# Altium project 宝宝主板_V7.PrjPcb
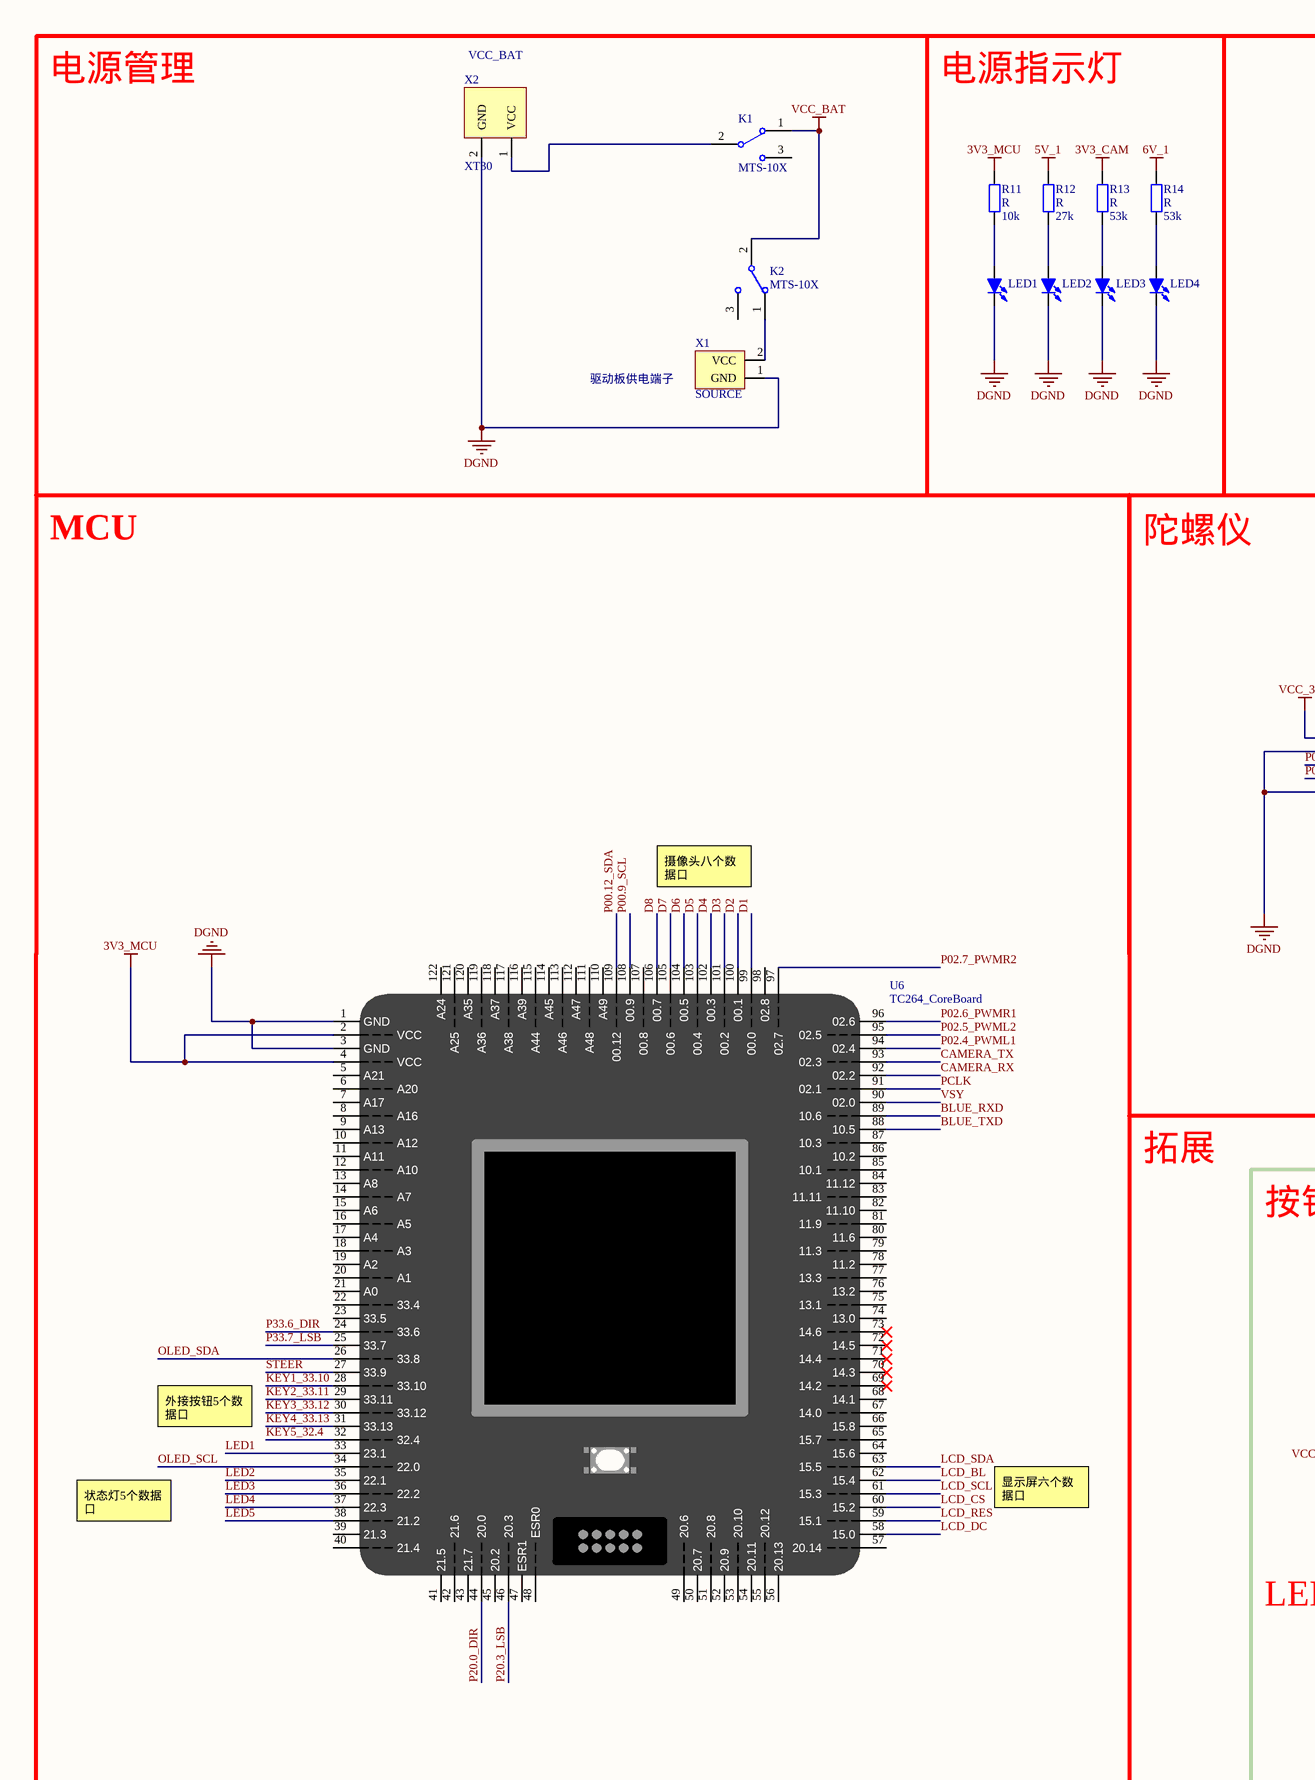
[diagram p0: 宝宝主板_V7.SchDoc, left]
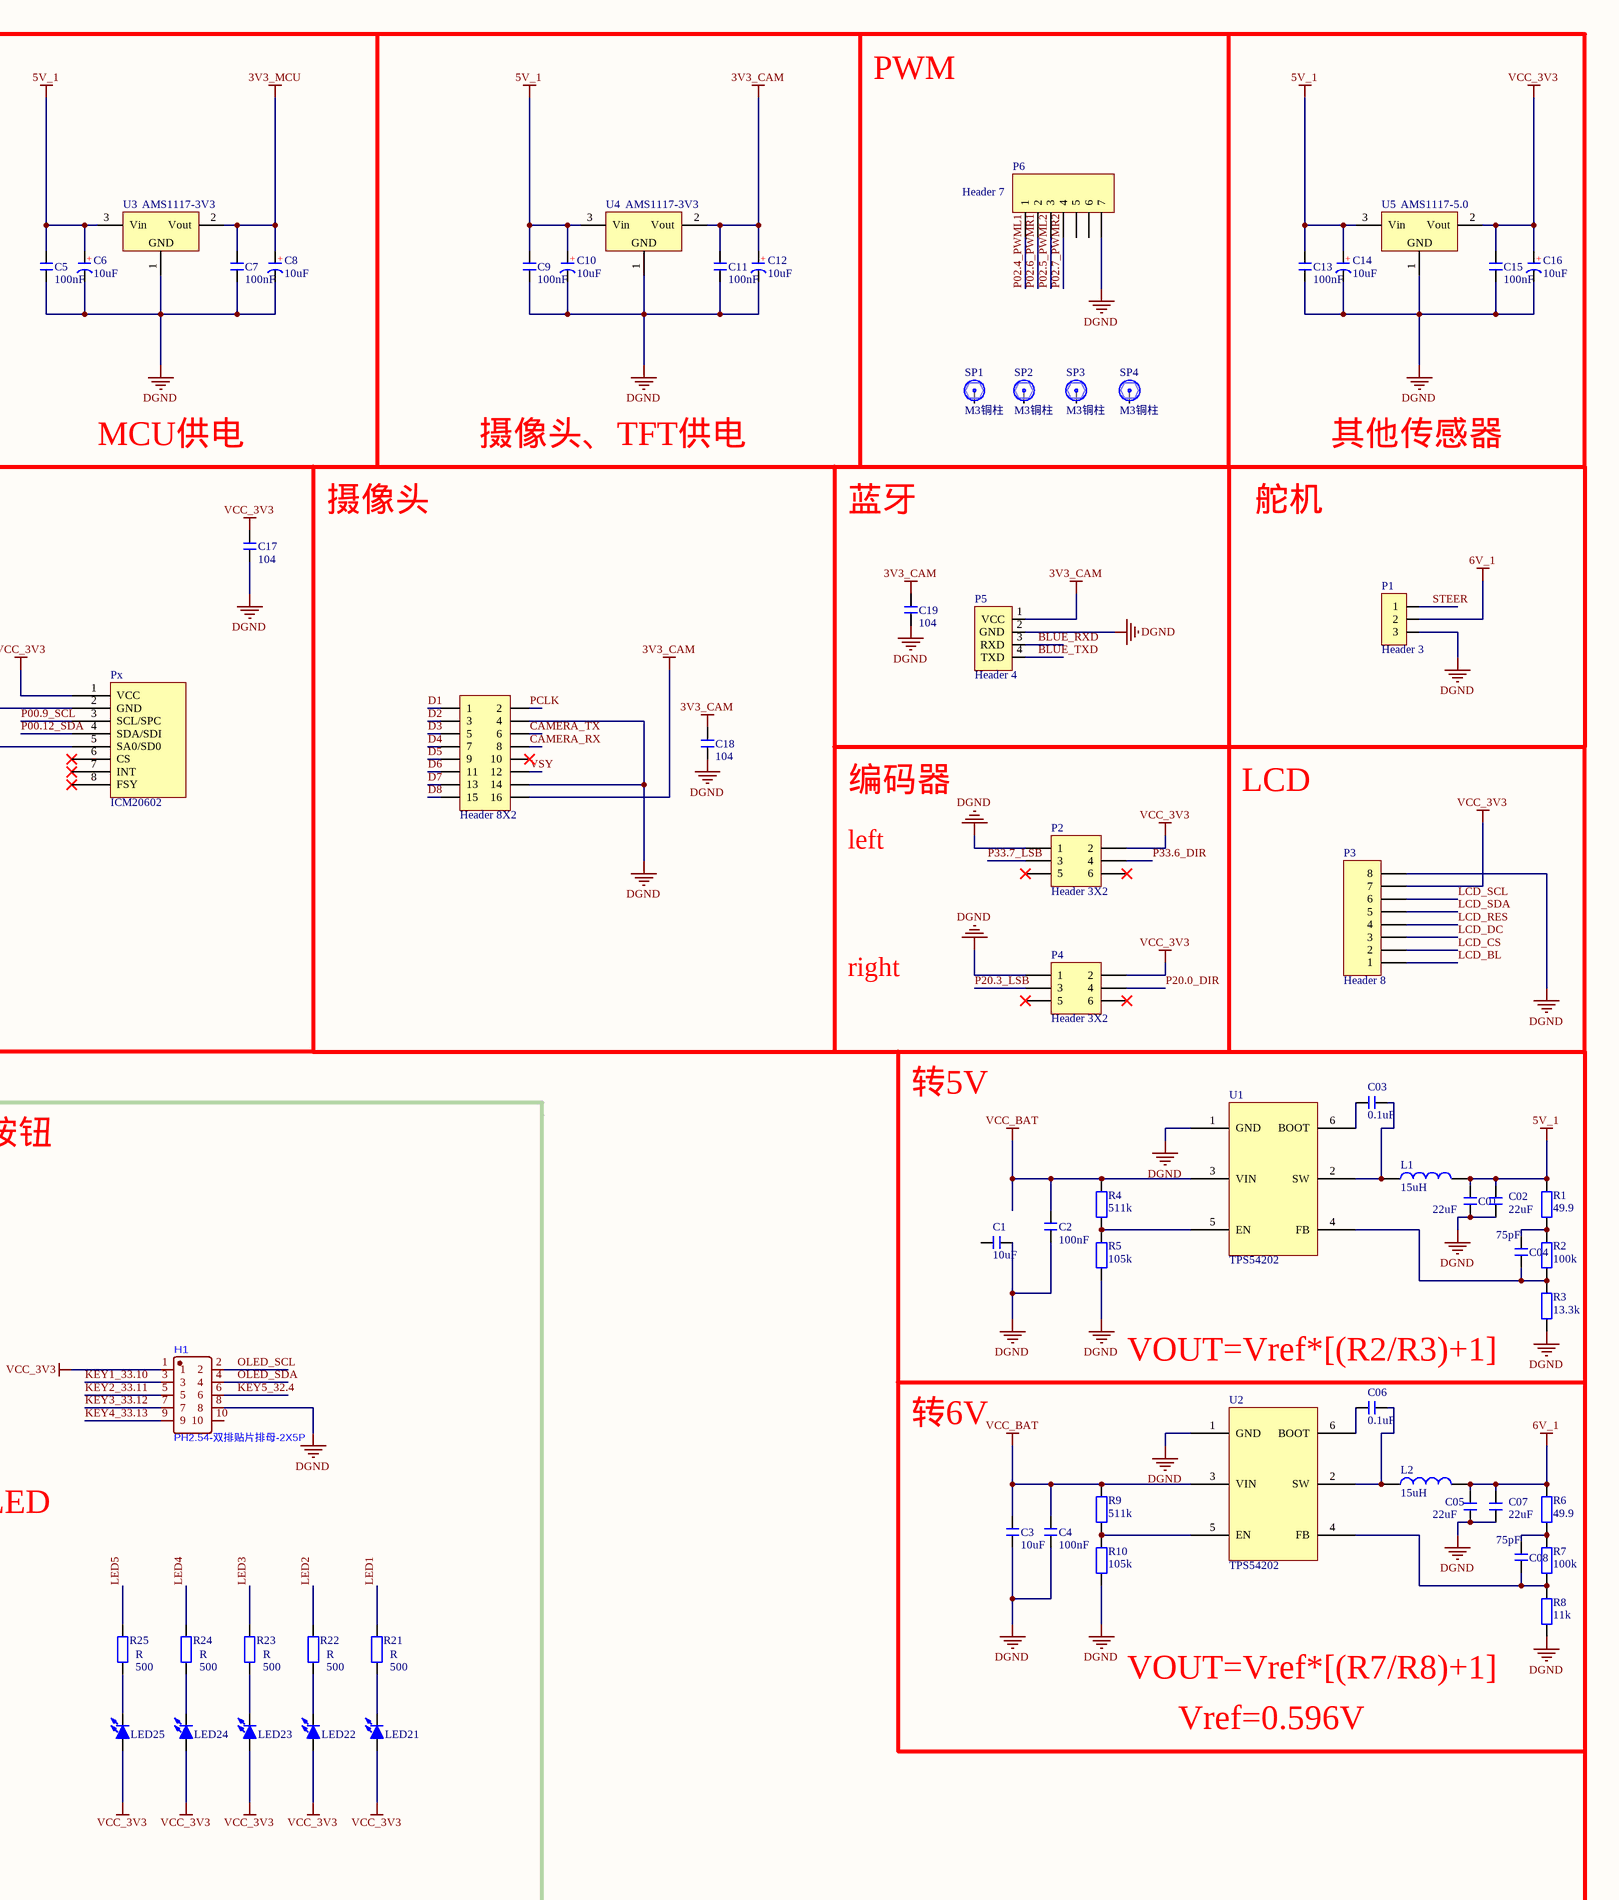
[diagram p1: 宝宝主板_V7.SchDoc, right]
1 sheet, 80 parts. Net scope: global (net labels, ports and power ports of the same name join across sheets).
Board file: 宝宝主板_V7.PcbDoc

## Sheet 宝宝主板_V7.SchDoc
size A2; SheetNumber: 1; SheetTotal: 1

### Parts
C1  value 10uF  [C 0603_M]  (hidden comment: C)
C01  value 22uF  [C 0603_M]  (hidden comment: C)
C2  value 100nF  [C 0603_M]  (hidden comment: C)
C02  value 22uF  [C 0603_M]  (hidden comment: C)
C03  value 0.1uF  [C 0603_M]  (hidden comment: C)
C3  value 10uF  [C 0603_M]  (hidden comment: C)
C4  value 100nF  [C 0603_M]  (hidden comment: C)
C04  value 75pF  [C 0603_M]  (hidden comment: C)
C5  value 100nF  [C 0603_M]  (hidden comment: C)
C05  value 22uF  [C 0603_M]  (hidden comment: C)
C6  value 10uF  [CD B(3528)]  (hidden comment: C-CD)
C06  value 0.1uF  [C 0603_M]  (hidden comment: C)
C7  value 100nF  [C 0603_M]  (hidden comment: C)
C07  value 22uF  [C 0603_M]  (hidden comment: C)
C8  value 10uF  [CD B(3528)]  (hidden comment: C-CD)
C08  value 75pF  [C 0603_M]  (hidden comment: C)
C9  value 100nF  [C 0603_M]  (hidden comment: C)
C10  value 10uF  [CD B(3528)]  (hidden comment: C-CD)
C11  value 100nF  [C 0603_M]  (hidden comment: C)
C12  value 10uF  [CD B(3528)]  (hidden comment: C-CD)
C13  value 100nF  [C 0603_M]  (hidden comment: C)
C14  value 10uF  [CD B(3528)]  (hidden comment: C-CD)
C15  value 100nF  [C 0603_M]  (hidden comment: C)
C16  value 10uF  [CD B(3528)]  (hidden comment: C-CD)
C17  104  [C 0603]
C18  104  [C 0603]
C19  104  [C 0603]
H1  PH2.54-双排贴片排母-2X5P  [HDR-SMD_10P-P2.54-V-F-R2-C5-S7.6]
Header_8X2  Header 8X2  [HDR2.54-LI-2x8P]  (value not drawn)
K1  MTS-10X  [MTS-10x]
K2  MTS-10X  [MTS-10x]
L1  15uH  [L 7*7]
L2  15uH  [L 7*7]
LED1  红色  [LED 0603Y]  (value not drawn)
LED2  红色  [LED 0603Y]  (value not drawn)
LED3  红色  [LED 0603Y]  (value not drawn)
LED4  红色  [LED 0603Y]  (value not drawn)
LED21  红色  [LED 0603Y]  (value not drawn)
LED22  红色  [LED 0603Y]  (value not drawn)
LED23  红色  [LED 0603Y]  (value not drawn)
LED24  红色  [LED 0603Y]  (value not drawn)
LED25  红色  [LED 0603Y]  (value not drawn)
P1  Header 3  [HDR2.54-LI-3P]
P2  Header 3X2  [HDR2X3]
P3  Header 8  [HDR1X8]
P4  Header 3X2  [HDR2X3]
P5  Header 4  [HDR2.54-M-LI-4P]
P6  Header 7  [PH2.0-L-Z-7P]
Px  ICM20602  [ICM20602]
R1  value 49.9  [R 0603_L]  (hidden comment: R)
R2  value 100k  [R 0603_L]  (hidden comment: R)
R3  value 13.3k  [R 0603_L]  (hidden comment: R)
R4  value 511k  [R 0603_L]  (hidden comment: R)
R5  value 105k  [R 0603_L]  (hidden comment: R)
R6  value 49.9  [R 0603_L]  (hidden comment: R)
R7  value 100k  [R 0603_L]  (hidden comment: R)
R8  value 11k  [R 0603_L]  (hidden comment: R)
R9  value 511k  [R 0603_L]  (hidden comment: R)
R10  value 105k  [R 0603_L]  (hidden comment: R)
R11  R  value 10k  [R 0603_L]
R12  R  value 27k  [R 0603_L]
R13  R  value 53k  [R 0603_L]
R14  R  value 53k  [R 0603_L]
R21  R  value 500  [R 0603_L]
R22  R  value 500  [R 0603_L]
R23  R  value 500  [R 0603_L]
R24  R  value 500  [R 0603_L]
R25  R  value 500  [R 0603_L]
SP1  M3铜柱  [M3孔]
SP2  M3铜柱  [M3孔]
SP3  M3铜柱  [M3孔]
SP4  M3铜柱  [M3孔]
U1  TPS54202  [SOT23-6]
U2  TPS54202  [SOT23-6]
U3  AMS1117-3V3  [SOT223_L]
U4  AMS1117-3V3  [SOT223_L]
U5  AMS1117-5.0  [SOT223_L]
U6  TC264_CoreBoard  [PCBComponent_1]
X1  SOURCE  [KF128-5.08-2P]
X2  XT30  [XT30-M]

### Nets
3V3_CAM: C11.2 C12.1(A) C18.1 C19.1 Header_8X2.16 P5.1(VCC) R13.2 U4.2(Vout)
3V3_MCU: C7.2 C8.1(A) R11.2 U3.2(Vout) U6.2(VCC) U6.4(VCC)
5V_1: C01.2 C02.2 C5.2 C6.1(A) C9.2 C10.1(A) C13.2 C14.1(A) L1.2 R1.2 R12.2 U3.3(Vin) U4.3(Vin) U5.3(Vin)
6V_1: C05.2 C07.2 L2.2 P1.2 R6.2 R14.2
DGND: C1.1 C01.1 C2.1 C02.1 C3.1 C4.1 C5.1 C05.1 C6.2(K) C7.1 C07.1 C8.2(K) C9.1 C10.2(K) C11.1 C12.2(K) C13.1 C14.2(K) C15.1 C16.2(K) C17.2 C18.2 C19.2 H1.8 Header_8X2.4 Header_8X2.14 LED1.2(K) LED2.2(K) LED3.2(K) LED4.2(K) P1.3 P2.1 P3.8 P4.1 P5.2(GND) P6.7 Px.2(GND) Px.5(SA0/SD0) R3.1 R5.1 R8.1 R10.1 U1.1(GND) U2.1(GND) U3.1(GND) U4.1(GND) U5.1(GND) U6.1(GND) U6.3(GND) X1.1(GND) X2.2(GND)
VCC_3V3: C15.2 C16.1(A) C17.1 H1.1 LED21.1(A) LED22.1(A) LED23.1(A) LED24.1(A) LED25.1(A) P2.2 P3.7 P4.2 Px.1(VCC) U5.2(Vout)
VCC_BAT: C2.2 C3.2 C4.2 K1.1 K2.2 R4.2 R9.2 U1.3(VIN) U2.3(VIN)
BLUE_RXD: P5.3(RXD) U6.89(10.6)
BLUE_TXD: P5.4(TXD) U6.88(10.5)
CAMERA_RX: Header_8X2.8 U6.92(02.2)
CAMERA_TX: Header_8X2.6 U6.93(02.3)
D1: Header_8X2.1 U6.99(00.0)
D2: Header_8X2.3 U6.100(00.1)
D3: Header_8X2.5 U6.101(00.2)
D4: Header_8X2.7 U6.102(00.3)
D5: Header_8X2.9 U6.103(00.4)
D6: Header_8X2.11 U6.104(00.5)
D7: Header_8X2.13 U6.105(00.6)
D8: Header_8X2.15 U6.106(00.7)
KEY1_33.10: H1.3 U6.28(33.10)
KEY2_33.11: H1.5 U6.29(33.11)
KEY3_33.12: H1.7 U6.30(33.12)
KEY4_33.13: H1.9 U6.31(33.13)
KEY5_32.4: H1.6 U6.32(32.4)
LCD_BL: P3.1 U6.62(15.4)
LCD_CS: P3.2 U6.60(15.2)
LCD_DC: P3.3 U6.58(15.0)
LCD_RES: P3.4 U6.59(15.1)
LCD_SCL: P3.6 U6.61(15.3)
LCD_SDA: P3.5 U6.63(15.5)
LED1: R21.2 U6.33(23.1)
LED2: R22.2 U6.35(22.1)
LED3: R23.2 U6.36(22.2)
LED4: R24.2 U6.37(22.3)
LED5: R25.2 U6.38(21.2)
OLED_SCL: H1.2 U6.34(22.0)
OLED_SDA: H1.4 U6.26(33.8)
P00.9_SCL: Px.3(SCL/SPC) U6.108(00.9)
P00.12_SDA: Px.4(SDA/SDI) U6.109(00.12)
P02.4_PWML1: P6.1 U6.94(02.4)
P02.5_PWML2: P6.3 U6.95(02.5)
P02.6_PWMR1: P6.2 U6.96(02.6)
P02.7_PWMR2: P6.4 U6.97(02.7)
P20.0_DIR: P4.4 U6.44(20.0)
P20.3_LSB: P4.3 U6.46(20.3)
P33.6_DIR: P2.4 U6.24(33.6)
P33.7_LSB: P2.3 U6.25(33.7)
PCLK: Header_8X2.2 U6.91(02.1)
STEER: P1.1 U6.27(33.9)
VSY: Header_8X2.12 U6.90(02.0)
NetC03_1: C03.1 L1.1 U1.2(SW)
NetC03_2: C03.2 U1.6(BOOT)
NetC04_1: C04.1 R2.1 R3.2 U1.4(FB)
NetC04_2: C04.2 R1.1 R2.2
NetC06_1: C06.1 L2.1 U2.2(SW)
NetC06_2: C06.2 U2.6(BOOT)
NetC08_1: C08.1 R7.1 R8.2 U2.4(FB)
NetC08_2: C08.2 R6.1 R7.2
NetK1_2: K1.2 X2.1(VCC)
NetK2_1: K2.1 X1.2(VCC)
NetLED1_1: LED1.1(A) R11.1
NetLED2_1: LED2.1(A) R12.1
NetLED3_1: LED3.1(A) R13.1
NetLED4_1: LED4.1(A) R14.1
NetLED21_2: LED21.2(K) R21.1
NetLED22_2: LED22.2(K) R22.1
NetLED23_2: LED23.2(K) R23.1
NetLED24_2: LED24.2(K) R24.1
NetLED25_2: LED25.2(K) R25.1
NetR4_1: R4.1 R5.2 U1.5(EN)
NetR9_1: R9.1 R10.2 U2.5(EN)

Not connected (* = marked no-connect by the designer): C1 2; H1 10; Header_8X2 10*; K1 3; K2 3; P2 5* 6*; P4 5* 6*; P6 5 6; Px 6(CS)* 7(INT)* 8(FSY)*; SP1 1; SP2 1; SP3 1; SP4 1; U6 5(A21) 6(A20) 7(A17) 8(A16) 9(A13) 10(A12) 11(A11) 12(A10) 13(A8) 14(A7) 15(A6) 16(A5) 17(A4) 18(A3) 19(A2) 20(A1) 21(A0) 22(33.4) 23(33.5) 39(21.3) 40(21.4) 41(21.5) 42(21.6) 43(21.7) 45(20.2) 47(ESR1) 48(ESR0) 49(20.6) 50(20.7) 51(20.8) 52(20.9) 53(20.10) 54(20.11) 55(20.12) 56(20.13) 57(20.14) 64(15.6) 65(15.7) 66(15.8) 67(14.0) 68(14.1) 69(14.2)* 70(14.3)* 71(14.4)* 72(14.5)* 73(14.6)* 74(13.0) 75(13.1) 76(13.2) 77(13.3) 78(11.2) 79(11.3) 80(11.6) 81(11.9) 82(11.10) 83(11.11) 84(11.12) 85(10.1) 86(10.2) 87(10.3) 98(02.8) 107(00.8) 110(A49) 111(A48) 112(A47) 113(A46) 114(A45) 115(A44) 116(A39) 117(A38) 118(A37) 119(A36) 120(A35) 121(A25) 122(A24)

### Notes on the sheet
- 电源管理
- VCC_BAT
- 电源指示灯
- PWM
- 驱动板供电端子
- MCU供电
- 摄像头、TFT供电
- 其他传感器
- MCU
- 陀螺仪
- 摄像头
- 蓝牙
- 舵机
- 编码器
- LCD
- 摄像头八个数据口
- left
- right
- 拓展
- 转5V
- 按钮
- 外接按钮5个数据口
- VOUT=Vref*[(R2/R3)+1]
- 状态灯5个数据口
- 显示屏六个数据口
- 转6V
- LED
- VOUT=Vref*[(R7/R8)+1]
- Vref=0.596V
- Title
- Size:
- Date:
- File:
- A2
- Number:
- Time:
- Revision:
- Sheet
- of
- (in symbol C-CD) +

### Library data of the parts
C1 C01 C2 C02 C03 C3 C4 C04 C5 C05 C06 C7 C07 C08 C9 C11 C13 C15 = C: 无极性贴片电容; 版权归属: 电协硬件组
C6 C8 C10 C12 C14 C16 = C-CD: 贴片钽电容; 版权归属: 电协硬件组
C17-C19 = C: 无极性贴片电容; 版权归属: 源创客; BOM名称: 无极性贴片电容; 学习资源: www.ooocke.com
Header_8X2 = Header 8X2: 8*2P接插件; 版权归属: 源创客; BOM名称: 8*2P接插件; 学习资源: www.ooocke.com
K1 K2 = MTS-10X: 钮子开关
L1 L2 = L: 功率电感
LED1-LED4 LED21-LED25 = LED-SMD: 贴片LED; 版权归属: 源创客; BOM名称: 贴片LED; 学习资源: www.ooocke.com
P1 = CON3
P2 P4 = Header 3X2: Header, 3-Pin, Dual row; LatestRevisionDate: 17-Jul-2002; LatestRevisionNote: Re-released for DXP Platform.; Publisher: Altium Limited
P3 = Header 8: Header, 8-Pin; LatestRevisionDate: 17-Jul-2002; LatestRevisionNote: Re-released for DXP Platform.; Publisher: Altium Limited
P5 = 串口: 蓝牙
P6 = Header 7: Header, 7-Pin; LatestRevisionDate: 17-Jul-2002; LatestRevisionNote: Re-released for DXP Platform.; Publisher: Altium Limited
R1-R14 R21-R25 = R: 贴片电阻; 版权归属: 电协硬件组
SP1-SP4 = 铜柱: 版权归属: 封装库来自淘宝 ID：黄晶宝石; 封装库来自淘宝卖家 ID：黄晶宝石: 其他店铺购入均为盗版，不享受售后技术支持服务，请立即申请退款; BOM名称: 铜柱; 技术支持，联系售后: https://shop463601444.taobao.com
U1 U2 = TPS54202: ic降压
U3-U5 = AMS1117: 三端稳压芯片; 版权归属: 电协硬件组
U6 = TC264_CoreBoard: 逐飞科技TC264核心板
X1 = Source_端子
X2 = XT30: XT30-M